# EAGLE design DPA110.thales verzia (EAGLE 5.10)
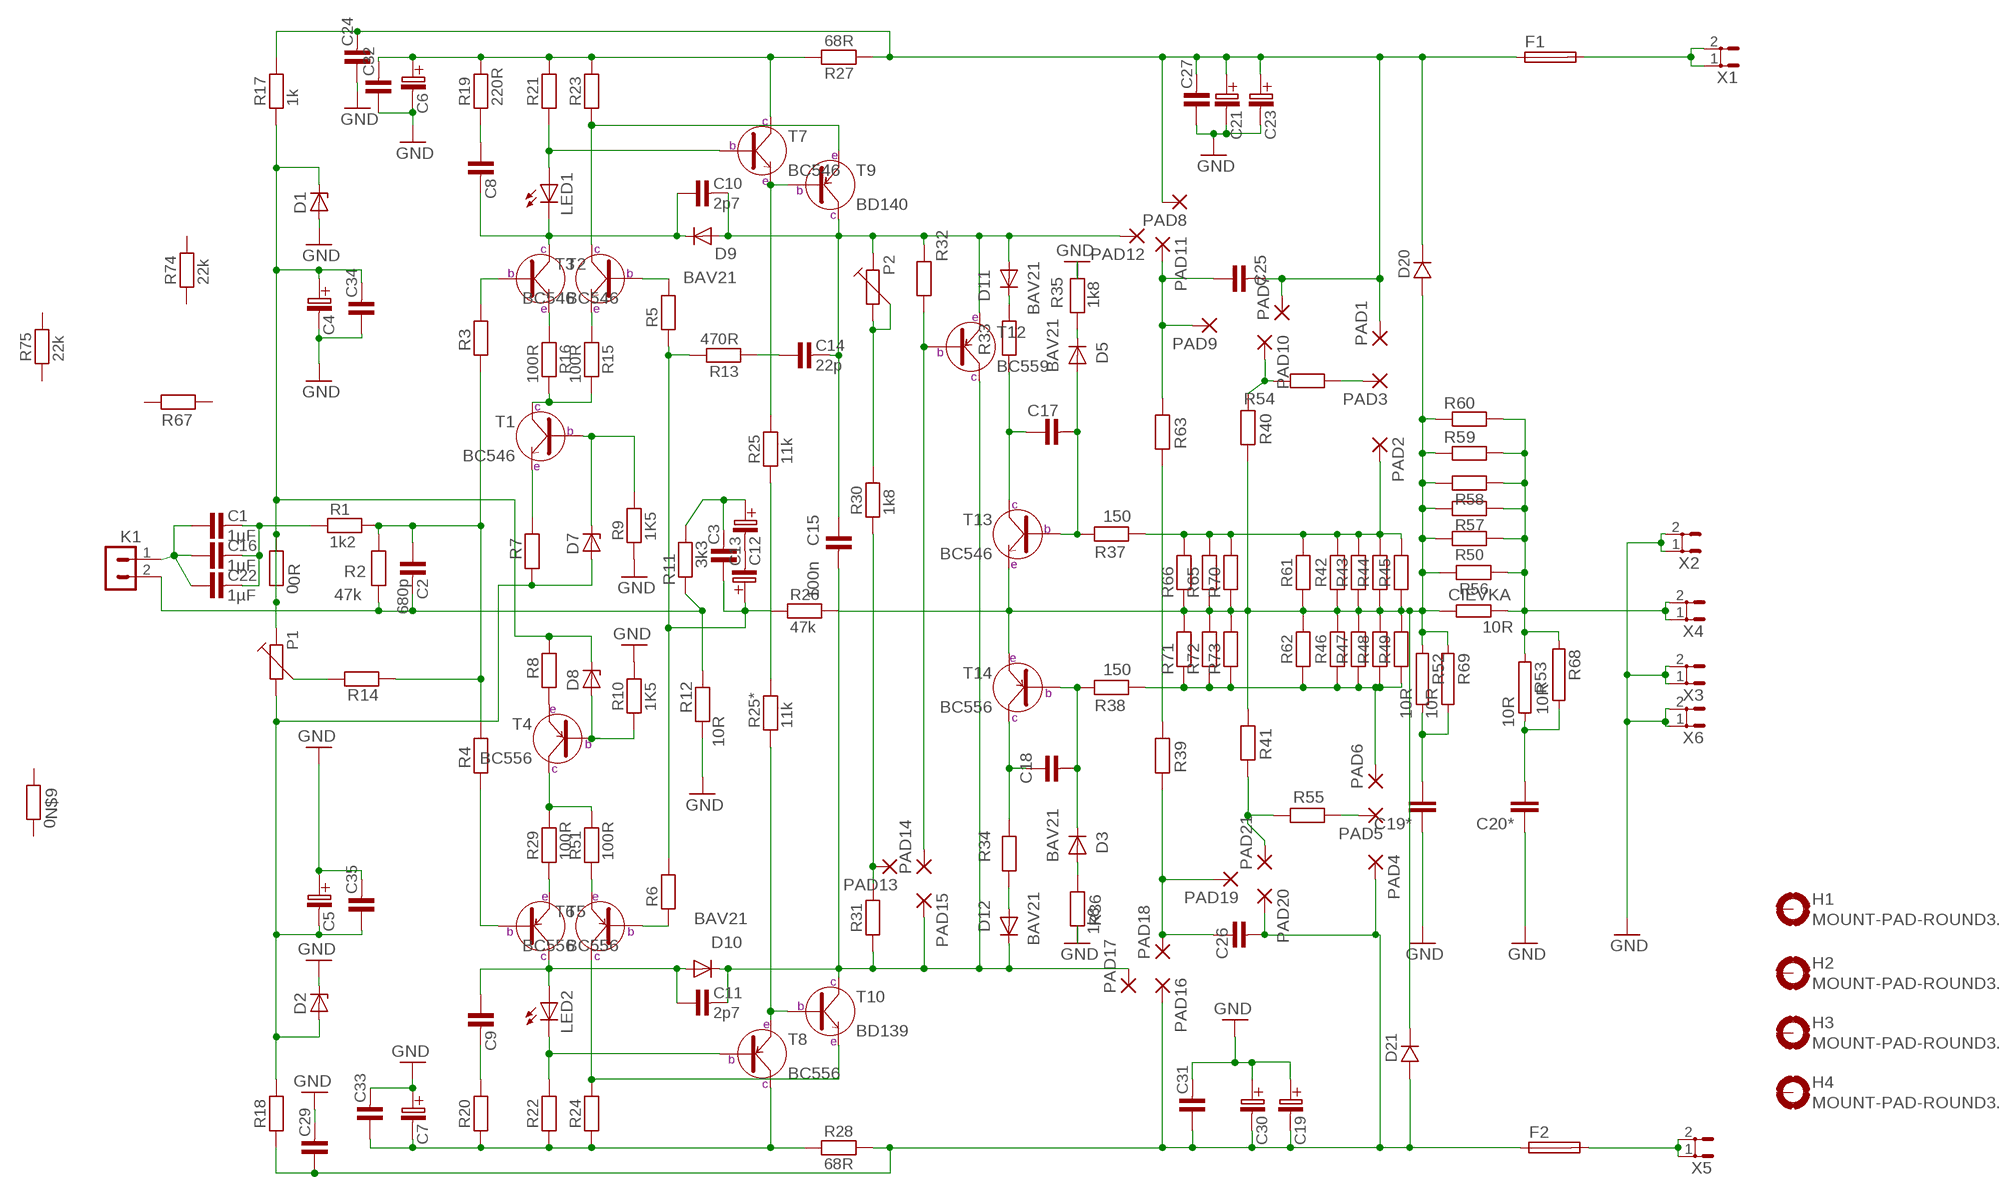
[diagram p0: schematic, sheet 1]

## Parts
0R  0  R_10  [R-10]
C1  1µF  C-KERAMIK_5  [C-5]
C2  680p  C-KERAMIK_5  [C-5]
C3  C-KERAMIK_5  [C-5]
C4  C-ELEKTROLYT_2  [C-EL_2]
C5  C-ELEKTROLYT_2  [C-EL_2]
C6  C-ELEKTROLYT_3,5  [C-EL_3,5]
C7  C-ELEKTROLYT_3,5  [C-EL_3,5]
C8  C-KERAMIK_5  [C-5]
C9  C-KERAMIK_5  [C-5]
C10  2p7  C-KERAMIK_5  [C-5]
C11  2p7  C-KERAMIK_5  [C-5]
C12  C-ELEKTROLYT_3,5  [C-EL_3,5]
C13  C-ELEKTROLYT_3,5  [C-EL_3,5]
C14  22p  C-KERAMIK_5  [C-5]
C15  100n  C-KERAMIK_5  [C-5]
C16  1µF  C-KERAMIK_5  [C-5]
C17  C-KERAMIK_5  [C-5]
C18  C-KERAMIK_5  [C-5]
C19  C-ELEKTROLYT_3,5  [C-EL_3,5]
C19*  C-EU150-054X183  [C150-054X183]
C20*  C-EU150-054X183  [C150-054X183]
C21  C-ELEKTROLYT_3,5  [C-EL_3,5]
C22  1µF  C-KERAMIK_5  [C-5]
C23  C-ELEKTROLYT_3,5  [C-EL_3,5]
C24  C-KERAMIK_5  [C-5]
C25  C-KERAMIK_5  [C-5]
C26  C-KERAMIK_5  [C-5]
C27  C-KERAMIK_5  [C-5]
C29  C-KERAMIK_5  [C-5]
C30  C-ELEKTROLYT_3,5  [C-EL_3,5]
C31  C-KERAMIK_5  [C-5]
C32  C-KERAMIK_5  [C-5]
C33  C-KERAMIK_5  [C-5]
C34  C-KERAMIK_5  [C-5]
C35  C-KERAMIK_5  [C-5]
CIEVKA  10R  R-EU_0617/22  [0617/22]
D1  BZD23  [SOD81]
D2  BZD23  [SOD81]
D3  BAV21  [DO35-10]
D5  BAV21  [DO35-10]
D7  BZX55  [DO35Z10]
D8  BZX55  [DO35Z10]
D9  BAV21  [DO35-10]
D10  BAV21  [DO35-10]
D11  BAV21  [DO35-10]
D12  BAV21  [DO35-10]
D20  D_10  [DO41]
D21  D_10  [DO41]
F1  SH22,5A  [SH22,5A]
F2  SH22,5A  [SH22,5A]
H1  MOUNT-PAD-ROUND3.3  [3,3-PAD]
H2  MOUNT-PAD-ROUND3.3  [3,3-PAD]
H3  MOUNT-PAD-ROUND3.3  [3,3-PAD]
H4  MOUNT-PAD-ROUND3.3  [3,3-PAD]
K1  PSH02-02P  [PSH02-02P]
LED1  LED5MM  [LED5MM]
LED2  LED5MM  [LED5MM]
N$9  0  R_10  [R-10]
P1  TRIMR64Y  [64Y]
P2  TRIMR64Y  [64Y]
PAD1  3,81/1,4  [3,81/1,4]
PAD2  3,81/1,4  [3,81/1,4]
PAD3  3,81/1,4  [3,81/1,4]
PAD4  3,81/1,4  [3,81/1,4]
PAD5  3,81/1,4  [3,81/1,4]
PAD6  3,81/1,4  [3,81/1,4]
PAD7  3,17/1,1  [3,17/1,1]
PAD8  3,17/1,1  [3,17/1,1]
PAD9  3,17/1,1  [3,17/1,1]
PAD10  3,17/1,1  [3,17/1,1]
PAD11  3,17/1,1  [3,17/1,1]
PAD12  3,17/1,1  [3,17/1,1]
PAD13  3,17/1,1  [3,17/1,1]
PAD14  3,17/1,1  [3,17/1,1]
PAD15  3,17/1,1  [3,17/1,1]
PAD16  3,17/1,1  [3,17/1,1]
PAD17  3,17/1,1  [3,17/1,1]
PAD18  3,17/1,1  [3,17/1,1]
PAD19  3,17/1,1  [3,17/1,1]
PAD20  3,17/1,1  [3,17/1,1]
PAD21  3,17/1,1  [3,17/1,1]
R1  1k2  R_10  [R-10]
R2  47k  R_10  [R-10]
R3  R_10  [R-10]
R4  R_10  [R-10]
R5  R_10  [R-10]
R6  R_10  [R-10]
R7  R_10  [R-10]
R8  R_10  [R-10]
R9  1K5  R_10  [R-10]
R10  1K5  R_10  [R-10]
R11  3k3  R_10  [R-10]
R12  10R  R_10  [R-10]
R13  470R  R_10  [R-10]
R14  R_10  [R-10]
R15  100R  R_7,5  [R-7,5]
R16  100R  R_7,5  [R-7,5]
R17  1k  R_10  [R-10]
R18  R_10  [R-10]
R19  220R  R_10  [R-10]
R20  R_10  [R-10]
R21  R_10  [R-10]
R22  R_10  [R-10]
R23  R_10  [R-10]
R24  R_10  [R-10]
R25  11k  R_10  [R-10]
R25*  11k  R_10  [R-10]
R26  47k  R_10  [R-10]
R27  68R  R_10  [R-10]
R28  68R  R_10  [R-10]
R29  100R  R_7,5  [R-7,5]
R30  1k8  R_10  [R-10]
R31  R_10  [R-10]
R32  R_10  [R-10]
R33  R_10  [R-10]
R34  R_10  [R-10]
R35  1k8  R_10  [R-10]
R36  1k8  R_10  [R-10]
R37  150  R_10  [R-10]
R38  150  R_10  [R-10]
R39  R_10  [R-10]
R40  R_10  [R-10]
R41  R_10  [R-10]
R42  R_10  [R-10]
R43  R_10  [R-10]
R44  R_10  [R-10]
R45  R_10  [R-10]
R46  R_10  [R-10]
R47  R_10  [R-10]
R48  R_10  [R-10]
R49  R_10  [R-10]
R50  R_10  [R-10]
R51  100R  R_7,5  [R-7,5]
R52  10R  RAC01  [AC01]
R53  10R  RAC01  [AC01]
R54  R_10  [R-10]
R55  R_10  [R-10]
R56  R_10  [R-10]
R57  R_10  [R-10]
R58  R_10  [R-10]
R59  R__2W  [R-_2W]
R60  R__2W  [R-_2W]
R61  R_10  [R-10]
R62  R_10  [R-10]
R63  R_10  [R-10]
R65  R__2W  [R-_2W]
R66  R__2W  [R-_2W]
R67  R_10  [R-10]
R68  10R  RAC01  [AC01]
R69  10R  RAC01  [AC01]
R70  R__2W  [R-_2W]
R71  R__2W  [R-_2W]
R72  R__2W  [R-_2W]
R73  R__2W  [R-_2W]
R74  22k  R_10  [R-10]
R75  22k  R_10  [R-10]
T1  BC546  [TO-92]
T2  BC546  [TO-92]
T3  BC546  [TO-92]
T4  BC556  [TO-92]
T5  BC556  [TO-92]
T6  BC556  [TO-92]
T7  BC546  [TO-92]
T8  BC556  [TO-92]
T9  BD140  [TO-126S]
T10  BD139  [TO-126S]
T12  BC559  [TO-92]
T13  BC546  [TO-92]
T14  BC556  [TO-92]
X1  ST4,8  [ST4,8]
X2  ST4,8  [ST4,8]
X3  ST4,8  [ST4,8]
X4  ST4,8  [ST4,8]
X5  ST4,8  [ST4,8]
X6  ST4,8  [ST4,8]

## Nets
AERT?ZQA??: R25*.2 R25.1
D7*: D8.A R10.1 T4.2(B)
GND: C4.C-(C_EL-) C5.C+(C_EL+) C6.C-(C_EL-) C7.C+(C_EL+) C19*.1 C19.C+(C_EL+) C20*.1 C21.C-(C_EL-) C23.C-(C_EL-) C24.1 C27.1 C29.2 C30.C+(C_EL+) C31.2 C32.1 C33.2 C34.1 C35.2 D1.A D2.C R9.1 R10.2 R12.1 R35.2 R36.1 X2.1 X2.2 X3.1 X3.2 X6.1 X6.2
N$1: C1.2 C16.2 C22.2 R1.1
N$2: C26.1 PAD18.1(P) PAD19.1(P) R39.1
N$3: C2.2 K1.2 R2.1 R11.1 R12.2
N$4: R7.2 T1.3(E)
N$5: C2.1 R1.2 R2.2 R3.1 R4.2 R14.1
N$6: R3.2 T2.2(B)
N$7: R16.1 T2.3(E)
N$8: D7.C R9.2 T1.2(B)
N$9: C5.C-(C_EL-) C35.1 D2.A D7.A P1.2 R7.1 R18.2
N$10: P1.3 R14.2
N$11: R8.1 T4.3(E)
N$12: R4.1 T5.2(B)
N$13: R29.1 T5.3(E)
N$14: R5.2 T3.2(B)
N$15: D5.C R35.1
N$16: R6.1 T6.2(B)
N$17: PAD3.1(P) R54.2
N$18: C3.1 C13.C+(C_EL+) R5.1 R6.2 R13.2 R26.1
N$19: C12.C-(C_EL-) C13.C-(C_EL-)
N$20: C6.C+(C_EL+) C32.2 R19.2 R21.2 R23.2 R27.2 T7.1(C)
N$21: C3.2 C12.C+(C_EL+) R11.2
N$22: C8.1 R19.1
N$23: C8.2 C10.1 D9.C LED1.K(C) T2.1(C)
N$24: LED2.K(C) R22.2 T8.2(B)
N$25: C19*.2 R52.2 R69.2
N$26: C25.1 PAD9.1(P) PAD11.1(P) R63.2
N$27: LED1.A R21.1 T7.2(B)
N$28: C9.2 R20.2
N$29: R23.1 T3.1(C) T9.1(E)
N$30: C7.C-(C_EL-) C33.1 R20.1 R22.1 R24.1 R28.1 T8.1(C)
N$31: R24.2 T6.1(C) T10.1(E)
N$33: R25.2 T7.3(E) T9.3(B)
N$34: C14.1 R13.1
N$35: C10.2 C14.2 C15.1 D9.A D11.A P2.1 PAD12.1(P) R32.2 T9.2(C) T12.3(E)
N$36: P2.2 P2.3 R30.2
N$37: C11.2 C15.2 D10.C D12.C PAD15.1(P) PAD17.1(P) R31.1 T10.2(C) T12.1(C)
N$38: PAD13.1(P) R30.1 R31.2
N$39: PAD14.1(P) R32.1 T12.2(B)
N$40: R15.1 T3.3(E)
N$41: PAD5.1(P) R55.1
N$42: D11.C R33.2
N$43: C17.1 R33.1 T13.1(C)
N$44: D12.A R34.1
N$45: C18.1 R34.2 T14.1(C)
N$46: D3.A R36.2
N$47: C17.2 D5.A R37.1 T13.2(B)
N$48: C18.2 D3.C R38.1 T14.2(B)
N$49: R15.2 R16.2 T1.1(C)
N$50: R39.2 R63.1
N$51: R51.1 T6.3(E)
N$53: C21.C+(C_EL+) C23.C+(C_EL+) C24.2 C25.2 C27.2 D20.K F1.1 PAD1.1(P) PAD7.1(P) PAD8.1(P) R17.2 R27.1
N$54: C19.C-(C_EL-) C26.2 C29.1 C30.C-(C_EL-) C31.1 D21.A F2.1 PAD4.1(P) PAD16.1(P) PAD20.1(P) R18.1 R28.2
N$55: R29.2 R51.2 T4.1(C)
N$56: PAD10.1(P) R40.2 R54.1
N$57: PAD21.1(P) R41.1 R55.2
N$58: PAD2.1(P) R37.2 R42.2 R43.2 R44.2 R45.2 R61.2 R65.2 R66.2 R70.2
N$59: PAD6.1(P) R38.2 R46.1 R47.1 R48.1 R49.1 R62.1 R71.1 R72.1 R73.1
N$61: F1.2 X1.1 X1.2
N$63: F2.2 X5.1 X5.2
N$67: C9.1 C11.1 D10.A LED2.A T5.1(C)
N$76: CIEVKA.1 D20.A D21.K R26.2 R40.1 R41.2 R42.1 R43.1 R44.1 R45.1 R46.2 R47.2 R48.2 R49.2 R50.2 R52.1 R56.2 R57.2 R58.2 R59.1 R60.1 R61.1 R62.2 R65.1 R66.1 R69.1 R70.1 R71.2 R72.2 R73.2 T13.3(E) T14.3(E)
N$77: R25*.1 T8.3(E) T10.3(B)
N$89: 0R.1 0R.2 C4.C+(C_EL+) C34.2 D1.C D8.C P1.1 R8.2 R17.1
N$180: C20*.2 R53.2 R68.2
N$181: C1.1 C16.1 C22.1 K1.1
OUT: CIEVKA.2 R50.1 R53.1 R56.1 R57.1 R58.1 R59.2 R60.2 R68.1 X4.1 X4.2
Unconnected: H1.B3,3(MOUNT) H2.B3,3(MOUNT) H3.B3,3(MOUNT) H4.B3,3(MOUNT) N$9.1 N$9.2 R67.1 R67.2 R74.1 R74.2 R75.1 R75.2

## Library data of the parts
0R N$9 R1-R3 R5-R12 R14 R19-R24 R25* R26-R28 R30 R31 R33 R34 = #PaJa_30:R: Rezistor
C1-C3 C10 C11 C14-C18 C22 C24-C27 C29 C31-C35 = #PaJa_22:C-KERAMIK: Kondenzator - keramicky
C4-C7 C12 C13 C19 C21 C23 C30 = #PaJa_22:C-ELEKTROLYT: Kondenzator - elektrolyticky
C8 C9 = #PaJa_30:C-KERAMIK: Kondenzator - keramicky
C19* C20* = rcl:C-EU: CAPACITOR, European symbol
CIEVKA = rcl:R-EU_: RESISTOR, European symbol
D1 D2 = DIODE moje:BZD23: Z DIODE
D3 D5 D9-D12 = DIODE moje:BAV21: DIODE high-voltage general purpose diode
D7 D8 = DIODE moje:BZX55: Z DIODE
D20 D21 = #PaJa_22:D: Dioda - univerzální
F1 F2 = fuse:SH22,5A: FUSE HOLDER grid 22,5mm, isolated cap OGN0031 8201, Schurter (Buerklin)
H1-H4 = holes:MOUNT-PAD-ROUND: MOUNTING PAD, round
K1 = #PaJa_22:PSH02-02: Konektory se zamkem - vidlice - 2pin
LED1 LED2 = LED moje:LED: LED OSRAM: - CHIPLED LG R971, LG N971, LY N971, LG Q971, LY Q971, LO R971, LY R971 LH N974, LH R974 LS Q976, LO Q976, LY Q976 LO Q996 - Hyper CHIPLED LW Q18S LB Q993, LB Q99A, LB R99A - SideLED LS A670, LO A670, LY A670, LG A670, LP A670 LB A673, LV A673, LT A673, LW A673 LH A674 LY A675 LS A676, LA A676, LO A676, LY A676, LW A676 LS A679, LY A679, LG A679 - Hyper Micro SIDELED® LS Y876, LA Y876, LO Y876, LY Y876 LT Y87S - SmartLED LW L88C, LW L88S LB L89C, LB L89S, LG L890 LS L89K, LO L89K, LY L89K LS L896, LA L896, LO L896, LY L896 - TOPLED LS T670, LO T670, LY T670, LG T670, LP T670 LSG T670, LSP T670, LSY T670, LOP T670, LYG T670 LG T671, LOG T671, LSG T671 LB T673, LV T673, LT T673, LW T673 LH T674 LS T676, LA T676, LO T676, LY T676, LB T676, LH T676, LSB T676, LW T676 LB T67C, LV T67C, LT T67C, LS T67K, LO T67K, LY T67K, LW E67C LS E67B, LA E67B, LO E67B, LY E67B, LB E67C, LV E67C, LT E67C LW T67C LS T679, LY T679, LG T679 LS T770, LO T770, LY T770, LG T770, LP T770 LB T773, LV T773, LT T773, LW T773 LH T774 LS E675, LA E675, LY E675, LS T675 LS T776, LA T776, LO T776, LY T776, LB T776 LHGB T686 LT T68C, LB T68C - Hyper Mini TOPLED® LB M676 - Mini TOPLED Santana® LG M470 LS M47K, LO M47K, LY M47K Source: http://www.osram.convergy.de/
P1 P2 = #PaJa_30:TRIMR: Trimr
PAD1-PAD6 = wirepad:3,81/1,4: THROUGH-HOLE PAD
PAD7-PAD21 = wirepad:3,17/1,1: THROUGH-HOLE PAD
R4 R13 R15-R18 R25 R29 R32 R35-R51 R54-R63 R65-R67 R70-R75 = #PaJa_22:R: Rezistor
R52 R53 R68 R69 = resistor-power:R: Power Resitor
T1-T3 T7 T13 = #PaJa_22:BC546: Tranzistor NPN - Univerzalni NF - Ic=0,1A
T4-T6 T8 T14 = #PaJa_22:BC556: Tranzistor PNP - Univerzalni NF - Ic=0,1A
T9 = #PaJa_22:BD140: Tranzistor PNP - Vykonovy - Ic=1,5A
T10 = #PaJa_22:BD139: Tranzistor NPN - Vykonovy - Ic=1,5A
T12 = #PaJa_22:BC559: Tranzistor PNP - Univerzalni NF - Ic=0,1A
X1-X6 = con-rib:ST4,8: RIBBON CABLE CONNECTOR Flachstecker / Faston

## Board
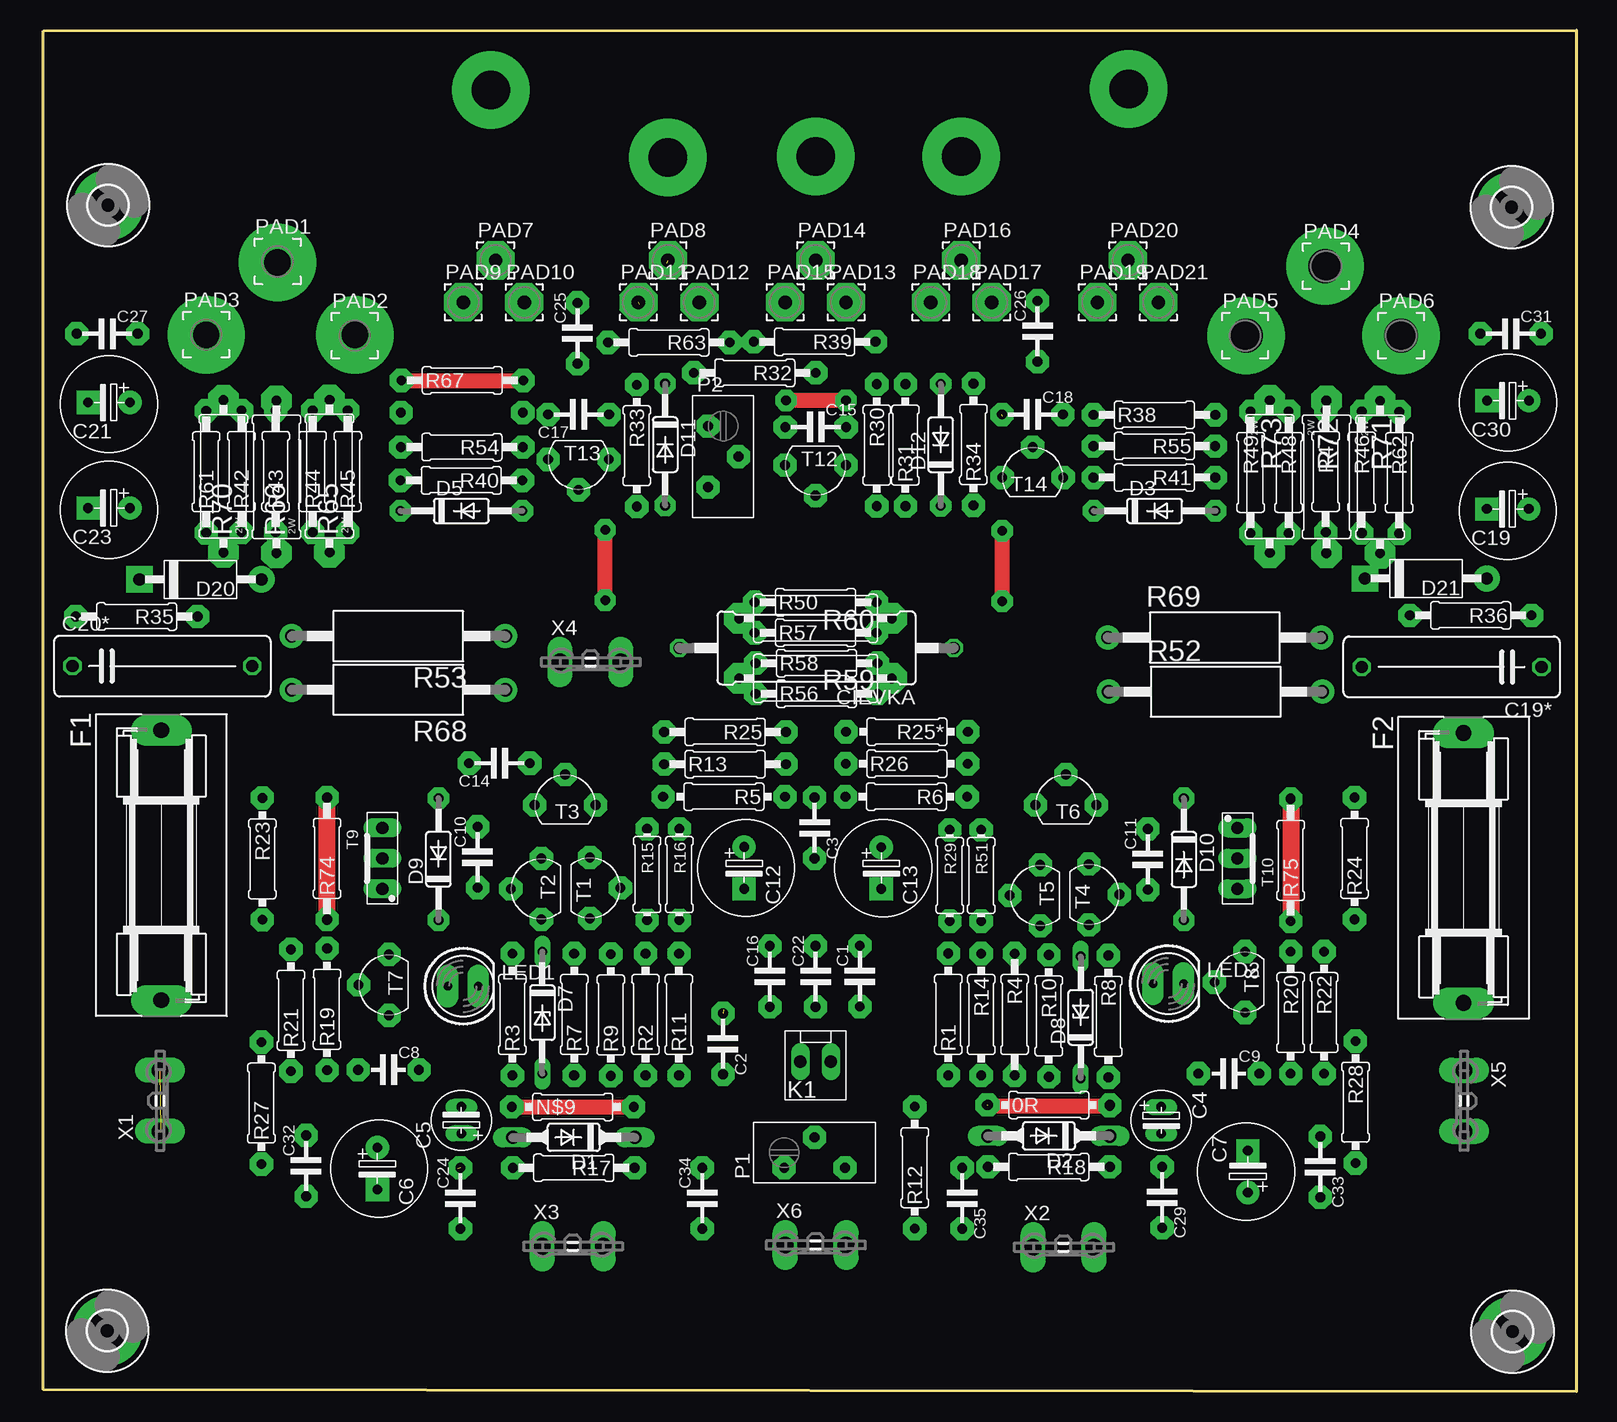
[diagram p1: board, top side]
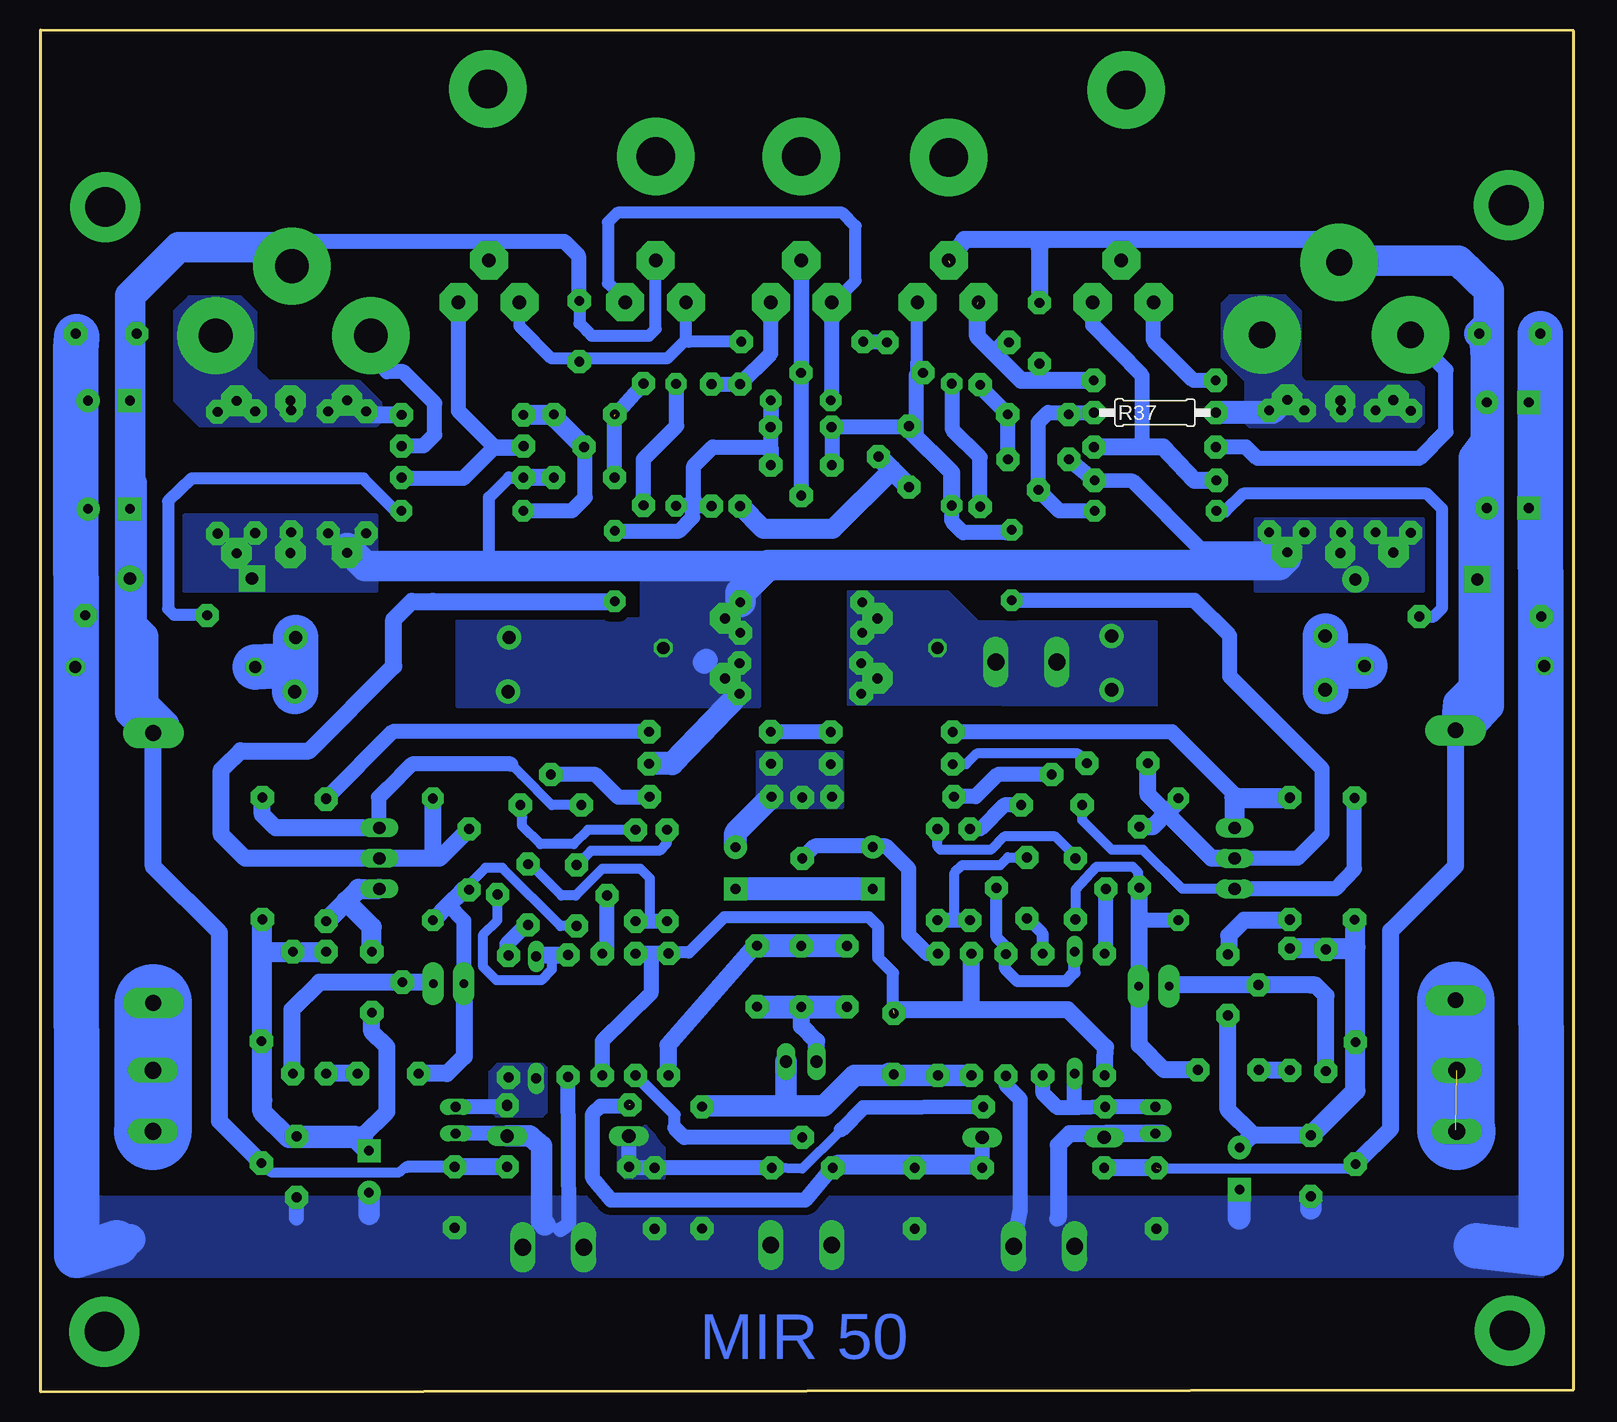
[diagram p2: board, bottom side, seen from below]

Size 127.79 x 113.51 mm. Coordinates in mm from the lower left corner, seen from the top.
Outline: 0,113.43 127.79,113.51 127.79,0 0,0.16 0,113.43
Copper layers (1*16): Top 0.035mm / dielectric 1.5mm / Bottom 0.035mm
Design rules "default": minimum track width 10mil, minimum drill 24mil, track to track 8mil, track to pad 8mil, pad to pad 8mil, via to via 8mil, smd to smd 8mil, copper to edge 40mil, drill to drill 8mil, minimum pad ring 10mil, minimum via ring 8mil, stop-mask expansion 4mil, vias tented up to drill 0mil, thermal gap 10mil

### Footprints (pad centres in the part's own frame; a part is rotated, then mirrored left to right if it is on the bottom)
R-10 = drill 0.813 pad 1.93 octagon: 1 -5.08,0; 2 5.08,0
C-5 = drill 0.813 pad 1.93 octagon: 1 -2.54,0; 2 2.54,0
C-EL_2 = drill 0.813 pad 1.27 long: C+ 0,0; C- 2.223,0
C-EL_3,5 = drill 0.813 pad 1.93 round: C+ 0,0 | drill 0.813 pad 1.93 square: C- 3.493,0
C150-054X183 = drill 1.016 octagon: 1 -7.493,0; 2 7.493,0
0617/22 = drill 1.016 octagon: 1 -11.43,0; 2 11.43,0
SOD81 = drill 1.118 long: A 5.08,0; C -5.08,0
DO35-10 = drill 0.813 pad 1.778 octagon: A 5.08,0; C -5.08,0
DO35Z10 = drill 0.813 long: A 5.08,0; C -5.08,0
DO41 = drill 1.016 pad 2.184 round: A -5.08,0 | drill 1.016 pad 2.184 square: K 5.08,0
SH22,5A = drill 1.321 pad 2.54 long: 1 -11.252,0; 2 11.252,0
3,3-PAD = drill 3.3 pad 5.842 round: B3,3 0,0
PSH02-02P = drill 1.016 pad 1.422 long: 1 -1.27,0; 2 1.27,0
LED5MM = drill 0.7 pad 1.778 long: A -1.27,0; K 1.27,0
64Y = drill 0.813 pad 1.93 octagon: 1 0,2.54; 2 0,-2.54; 3 2.54,0
3,81/1,4 = drill 1.397 pad 3.81 octagon: 1 0,0
3,17/1,1 = drill 1.118 pad 3.175 octagon: 1 0,0
R-7,5 = drill 0.813 pad 1.93 octagon: 1 -3.81,0; 2 3.81,0
AC01 = drill 1.1 pad 2 round: 1 -8.9,0; 2 8.9,0
R-_2W = drill 0.813 pad 2.54 octagon: 1 -6.35,0; 2 6.35,0
TO-92 = drill 0.813 pad 1.93 octagon: 1 0,2.54; 2 2.54,0; 3 0,-2.54
TO-126S = drill 1.016 pad 1.6 long: 1 -2.54,0; 2 0,0; 3 2.54,0
ST4,8 = drill 1.397 long: 1 -2.54,0; 2 2.54,0

### Placement (x,y rotation side)
0R  83.82,23.89 0 top
C1  68.06,34.62 90 top
C2  56.66,28.99 270 top
C3  64.29,46.99 270 top
C4  93.19,23.73 270 top
C5  34.85,21.51 90 top
C6  27.84,20.34 270 top
C7  100.41,16.59 90 top
C8  28.77,26.83 0 top
C9  98.82,26.51 0 top
C10  36.2,44.55 90 top
C11  92.07,44.37 90 top
C12  58.42,45.4 270 top
C13  69.85,45.39 270 top
C14  38.02,52.39 180 top
C15  64.39,80.41 0 top
C16  60.56,34.61 90 top
C17  44.62,81.46 180 top
C18  82.45,81.45 0 top
C19  123.82,73.58 180 top
C19*  117.4,60.4 180 top
C20*  9.92,60.48 0 top
C21  7.22,82.46 180 top
C22  64.37,34.61 90 top
C23  7.22,73.66 180 top
C24  34.77,16.11 90 top
C25  44.53,88.23 90 top
C26  82.88,88.39 90 top
C27  5.32,88.19 0 top
C29  93.27,16.19 270 top
C30  123.84,82.61 180 top
C31  122.32,88.19 0 top
C32  21.91,18.81 90 top
C33  106.44,18.73 270 top
C34  54.93,16.11 90 top
C35  76.6,16.11 270 top
CIEVKA  64.45,61.99 180 top
D1  44.21,21.19 180 top
D2  83.82,21.31 180 top
D3  92.63,73.42 0 top
D5  34.85,73.42 0 top
D7  41.59,31.59 270 top
D8  86.48,31.19 90 top
D9  32.94,44.39 90 top
D10  95.08,44.37 270 top
D11  51.83,78.95 270 top
D12  74.81,78.92 90 top
D20  13.1,67.71 180 top
D21  115.25,67.79 180 top
F1  9.83,43.88 270 top
F2  118.39,43.66 270 top
H1  5.4,98.9 0 top
H2  122.4,98.74 0 top
H3  5.32,5.08 0 top
H4  122.48,5 0 top
K1  64.37,27.51 0 top
LED1  34.99,33.8 0 top
LED2  93.78,34.01 0 top
N$9  44.13,23.73 0 top
P1  64.29,18.65 90 top
P2  55.4,77.95 0 top
PAD1  19.53,94.22 0 top
PAD2  25.96,88.03 0 top
PAD3  13.57,88.11 0 top
PAD4  106.92,93.82 0 top
PAD5  100.17,88.03 0 top
PAD6  113.19,88.03 0 top
PAD7  37.7,94.3 0 top
PAD8  52.07,94.3 0 top
PAD9  35,90.8 0 top
PAD10  40.08,90.81 0 top
PAD11  49.61,90.81 0 top
PAD12  54.69,90.81 0 top
PAD13  66.91,90.81 0 top
PAD14  64.37,94.3 0 top
PAD15  61.83,90.81 0 top
PAD16  76.52,94.3 0 top
PAD17  79.06,90.81 0 top
PAD18  73.98,90.81 0 top
PAD19  87.87,90.81 0 top
PAD20  90.41,94.3 0 top
PAD21  92.95,90.81 0 top
R1  75.44,31.45 90 top
R2  50.2,31.43 90 top
R3  39.09,31.43 90 top
R4  80.96,31.43 270 top
R5  56.74,49.59 180 top
R6  71.94,49.59 180 top
R7  44.25,31.43 90 top
R8  88.78,31.27 270 top
R9  47.31,31.39 90 top
R10  83.82,31.31 270 top
R11  52.98,31.43 90 top
R12  72.64,18.67 90 top
R13  56.83,52.31 0 top
R14  78.18,31.43 270 top
R15  50.32,43.1 270 top
R16  53.02,43.1 270 top
R17  44.21,18.65 180 top
R18  83.82,18.73 180 top
R19  23.65,31.87 90 top
R20  103.98,31.59 270 top
R21  20.64,31.79 90 top
R22  106.76,31.59 270 top
R23  18.26,44.41 270 top
R24  109.3,44.45 90 top
R25  56.83,54.99 180 top
R25*  71.99,55.01 180 top
R26  71.98,52.34 0 top
R27  18.18,24.05 90 top
R28  109.38,24.13 270 top
R29  75.56,43.02 270 top
R30  69.48,78.9 270 top
R31  71.86,78.9 90 top
R32  59.31,84.93 180 top
R33  49.47,78.85 270 top
R34  77.53,78.95 90 top
R35  7.78,64.61 180 top
R36  118.98,64.71 180 top
R37  34.89,81.61 0 bottom
R38  92.61,81.42 0 top
R39  64.29,87.52 180 top
R40  34.85,75.96 180 top
R41  92.61,76.2 180 top
R42  16.51,76.71 90 top
R43  19.37,76.71 90 top
R44  22.45,76.71 90 top
R45  25.37,76.71 90 top
R46  109.9,76.64 270 top
R47  106.9,76.71 270 top
R48  103.81,76.63 270 top
R49  100.65,76.63 270 top
R50  64.37,65.8 0 top
R51  78.18,43.02 270 top
R52  97.71,58.34 0 top
R53  29.61,62.98 180 top
R54  34.89,78.74 180 top
R55  92.61,78.82 180 top
R56  64.45,58.18 0 top
R57  64.37,63.26 0 top
R58  64.45,60.72 0 top
R59  64.37,59.45 180 top
R60  64.37,64.45 180 top
R61  13.57,76.68 90 top
R62  113.03,76.6 270 top
R63  52.15,87.47 180 top
R65  23.86,76.32 90 top
R66  19.44,76.25 90 top
R67  34.92,84.3 0 top
R68  29.61,58.5 180 top
R69  97.63,62.87 0 top
R70  15.01,76.3 90 top
R71  111.44,76.23 270 top
R72  106.96,76.26 270 top
R73  102.23,76.28 270 top
R74  23.65,44.45 90 top
R75  103.98,44.29 90 top
T1  45.56,41.99 0 top
T2  41.51,41.91 180 top
T3  43.5,48.9 90 top
T4  87.15,41.43 0 top
T5  83.11,41.35 180 top
T6  85.25,48.9 90 top
T7  28.81,33.89 180 top
T8  100.17,34.13 180 top
T9  28.26,44.45 90 top
T10  99.54,44.45 270 top
T12  64.37,77.23 270 top
T13  44.61,77.71 270 top
T14  82.47,76.2 90 top
X1  9.73,24.24 90 top
X2  85.04,12.03 0 top
X3  44.13,12.11 0 top
X4  45.61,60.82 0 top
X5  118.43,24.24 270 top
X6  64.37,12.22 0 top

### Tracks (layer width: path | path; a pad name or v marks a point on that pad's centre or on a via)
AERT?ZQA??
  Bottom 1.27: R25.1 66.85,54.99 R25*.2
D7*
  Bottom 0.813: T4.2 89.69,39.29 90.88,38.1 90.88,35.4 89.77,34.29 86.04,34.29 85.17,35.16 85.17,36.39
  Bottom 1.422: R10.1 85.17,36.39 86.2,36.39 D8.A
GND
  Bottom 1.27: R10.2 83.74,13.97 84.45,13.49 | 85.72,13.89 85.96,13.65 85.88,13.65 85.8,13.73 | C23.C- | 124.78,87.95 123.84,87.95 C30.C+ C19.C+ 124.06,73.58 R36.1 123.82,64.71 C19*.1 | C27.1 3.73,88.19 C21.C- C23.C- | C23.C- | C23.C- R35.2 3.73,64.61 C20*.1 | C4.C- 88.94,21.51 D2.C | C5.C+ 41.99,21.51 42.94,20.56 | 42.94,14.53 43.1,14.37 | R9.1 47.31,25.56 46.12,24.37 46.12,15.13 X3.2 | 106.36,16.27 106.44,16.27 106.44,14.45
  Bottom 1.422: D1.A 39.05,21.51 34.21,21.51 41.99,21.51 42.94,20.56 42.94,14.53
  Bottom 1.778: D2.C 87.03,21.31 86.04,20.48 86.04,14.21 85.72,13.89 | 100.41,14.76 C7.C+ | C32.1 21.91,15.56 21.91,15.24 | C31.2 124.86,87.23 124.86,86.91
  Bottom 1.93: 27.86,14.45 27.86,16.83
  Bottom 2.54: 121.44,12.38 120.33,12.7
  Bottom 3.81: C27.1 2.78,87.55 2.7,11.51 8.1,12.14 | 121.44,12.38 124.78,11.35 124.86,86.91 124.78,87.95
  pour Bottom (isolate 0.61, no thermals): 1.03,16.19 125.49,16.19 125.33,9.6 2.54,9.6
N$1
  Bottom 1.27: C1.2 67.4,37.16 67.39,37.15
  Bottom 1.422: C22.2 67.39,37.15 68.26,37.15 75.49,28.89 75.49,26.42 R1.1
  Bottom 1.93: C1.2 60.58,37.16 C16.2
N$2
  Bottom 1.016: R39.1 73.74,87.52 | 73.74,87.52 74.17,87.52 75.56,86.12 82.95,86.12 | 82.95,86.12 85.17,86.12 87.87,88.82 87.87,91.12 PAD19.1 | C26.1 82.88,85.64 82.95,85.8 82.95,86.12 | PAD18.1 73.98,87.76 73.74,87.52
N$3
  Bottom 1.778: R2.1 57.23,26.35 | 57.23,26.35 59.93,26.35 62.47,23.81 66.12,23.81 | 66.12,23.81 72.58,23.81 R12.2 | K1.2 65.64,24.29 66.12,23.81 | C2.2 57.06,26.53 57.23,26.35 | R2.1 R11.1 | R2.1
N$4
  Bottom 1.016: R7.2 44.25,38.14 T1.3
N$5  (1 unrouted)
  Bottom 1.016: 56.72,31.83 56.72,34.89 57.94,36.12 57.94,38.73 58.74,39.53 70.8,39.53 73.74,36.59 75.37,36.59 R1.2
  Bottom 1.27: R4.2 80.96,29.21 76.91,33.18 76.91,36.53 | R1.2 76.91,36.53 | 76.91,36.53 78.33,36.53 R14.1
  Bottom 1.422: R3.1 39.01,28.69 42.15,31.83 50.24,31.83 | 50.24,31.83 56.72,31.83 | R2.2 50.2,31.88 50.24,31.83
N$6
  Bottom 1.27: T2.2 38.97,36.63 R3.2
N$7
  Bottom 0.813: T2.3 41.51,44.61 43.18,46.28 47.47,46.28 48.58,45.16 52.78,45.16 53.02,45.4 R16.1 | R16.1
N$8
  Bottom 1.016: D7.C 41.59,34.92 42.31,34.21 46.35,34.21 47.39,35.24 47.39,36.59 47.39,37.15 48.1,37.86 T1.2 | T1.2
  Bottom 1.422: R9.2 47.31,36.51 47.39,36.59
N$9  (via drill 0.6 pad 1.68)
  Top 1.27: v39.05,23.73 v49.21,23.73
  Bottom 0.813: 61.04,21.83 61.2,21.67 64.29,18.57 P1.2
  Bottom 1.27: P1.2 74.69,18.65 | 74.69,18.65 78.5,18.65 R18.2 78.74,21.23 D2.A | C35.1 76.44,18.65 74.69,18.65 | C5.C- v39.05,23.73 41.27,23.65 | v49.21,23.73 59.21,23.65 61.04,21.83 | 41.27,23.65 43.02,23.65 44.21,24.84 44.21,26.31 R7.1 | D7.A 41.59,23.97 41.27,23.65
  pour Bottom (isolate 1.016, no thermals): 79.3,22.3 77.47,22.3 75.8,20.48 75.8,17.78 79.06,17.78 79.61,18.34 79.61,21.99
N$10
  Bottom 1.016: 74.93,21.99 74.93,23.1 R14.2
  Bottom 1.27: P1.3 74.14,21.19 74.93,21.99
N$11
  Bottom 1.27: T4.3 87.31,38.89 88.9,37.31 88.9,36.39 R8.1
N$12
  Bottom 1.27: T5.2 80.57,36.91 R4.1
N$13
  Bottom 0.813: R29.1 75.56,45.72 76.2,45.08 81.91,45.08 T5.3
N$14
  Bottom 1.27: T3.2 48.02,51.44 49.85,49.61 51.64,49.61 R5.2
N$15
  Bottom 1.016: D5.C 29.05,73.34 27.54,74.85 12.22,74.85 10.95,73.58 10.95,65.33 11.67,64.61 12.78,64.53 R35.1
N$16
  Bottom 1.27: T6.2 81.52,51.43 79.61,49.53 77.08,49.53 R6.1
N$17
  Bottom 1.27: R54.2 27.3,78.74 26.35,77.79 12.86,77.79 10.64,80.01 10.64,85.17 PAD3.1
N$18
  Bottom 1.93: C13.C+ 69.85,46.6 R6.2
  pour Bottom (no thermals): 60.96,52.86 60.96,48.66 68.02,48.66 68.02,53.34 60.96,53.34
N$19
  Bottom 1.93: C12.C- 69.83,41.91 C13.C-
N$20
  Bottom 1.422: 18.18,25.08 C32.2 26.67,21.35 26.75,21.43 | 26.75,21.43 28.81,23.49 T7.1 | T7.1 | C6.C+ | 26.75,21.43 C6.C+
  Bottom 1.676: 18.18,37.07 R27.2 18.18,25.08 C32.2 | 18.18,37.07 18.18,39.25 R23.2 | 18.3,36.95 R19.2 | 18.18,37.07 18.3,36.95 | R21.2 18.37,36.87 18.3,36.95
N$21
  Bottom 1.27: R11.2 53.9,36.51 55.4,38.02 55.4,43.58 57.31,45.48 57.86,45.48 | 57.86,45.48 63.26,45.48 C3.2 | C12.C+ 57.94,45.4 57.86,45.48
N$22
  Bottom 1.422: R19.1 25.16,26.79 C8.1
N$23
  Bottom 0.813: T2.1 41.51,41.83 39.77,43.74 36.75,43.74 36.27,43.26 36.27,41.93 C10.1
  Bottom 1.016: LED1.K 36.26,29.83 36.19,29.77
  Bottom 1.27: D9.C 35.89,39.31 36.19,39.61
  Bottom 1.422: C8.2 34.13,26.83 36.19,28.89 36.19,29.77 36.19,39.61 36.19,41.69 C10.1
N$24
  Bottom 1.422: LED2.K 95.01,34.13 T8.2 104.54,34.13 106.84,31.83 106.84,26.59 R22.2
N$25
  Bottom 3.81: 106.53,60.72 106.53,58.42 R52.2 | 106.53,60.72 R69.2 | C19*.2 106.69,60.56 106.53,60.72
N$26  (via drill 0.8 pad 1.78)  (1 unrouted)
  Top 1.27: v29.84,84.3 v40,84.3
  Bottom 1.27: v29.84,84.3 31.67,84.3 35,87.63 PAD9.1 | PAD9.1
  Bottom 1.422: v40,84.3 44.37,84.3 | 44.37,84.3 46.04,84.3 48.3,86.56 | 48.3,86.56 49.69,87.95 49.69,90.65 | R63.2 47.39,87.47 48.3,86.56 | C25.1 44.53,84.46 44.37,84.3
N$27
  Bottom 1.422: R21.1 20.64,33.02 21.51,33.89 21.91,33.89 | 21.91,33.89 33.62,33.89 LED1.A | 21.91,33.89 T7.2 | 21.91,33.89
N$28
  Bottom 1.422: C9.2 103.9,26.51 R20.2
N$29
  Bottom 0.813: T9.1 32.62,41.91 35.88,45.16 38.5,45.16 40.96,47.63 T3.1
  Bottom 1.27: T9.1 19.84,41.91 18.26,43.58 18.26,49.41 R23.1
N$30
  Bottom 1.422: T8.1 100.17,30 98.9,28.73 98.9,23.34 100.89,21.35 101.28,20.95 | R28.1 109.38,24.37 109.3,24.29
  Bottom 1.676: 109.3,36.75 109.3,24.29 109.3,23.34 107.08,21.11 101.12,21.11 100.89,21.35 | 109.3,36.75 109.3,36.83 | 109.3,36.83 R24.1 | R20.1 109.22,36.67 109.3,36.75 | R22.1 109.14,36.67 109.3,36.83
  Bottom 1.778: C33.1 101.6,21.27 101.28,20.95 C7.C-
N$31
  Bottom 0.813: T6.1 85.17,48.89 87.71,51.43 | 87.71,51.43 | 87.71,51.43 88.58,52.31
  Bottom 1.27: 88.58,52.31 96.84,52.31 98.9,50.24 | 98.9,50.24 | 98.9,50.24 99.62,49.53 99.62,47.07 T10.1
  Bottom 1.422: R24.2 109.3,48.1 108.19,46.99 T10.1
N$32  (via drill 0.6 pad 3.81)
  other vias: 37.46,108.59
N$33  (via drill 0.8 pad 1.78)
  Top 1.422: v23.65,39.29 v23.65,49.45
  Bottom 1.27: R25.2 33.48,54.99 27.94,49.45
  Bottom 1.422: v23.65,39.29 27.46,39.29 28.73,38.02 28.73,36.51 T7.3 | 28.1,49.45 28.26,49.45 | 28.26,49.45
  Bottom 1.676: 28.26,49.61 28.26,49.45 T9.3 | v23.65,49.45 27.94,49.45 28.1,49.45
N$34
  Bottom 0.813: R13.1 50.64,52.31 49.77,53.18 41.27,53.18 40.48,52.39 40.72,52.47 C14.1
N$35  (via drill 0.8 pad 1.78)
  Top 1.27: v46.83,65.96 v46.83,71.83
  Bottom 1.016: PAD12.1 54.77,84.3
  Bottom 1.27: T12.3 61.83,80.39 C15.1 55.48,80.41 P2.1 54.77,79.69 54.77,84.3 54.77,84.85 54.69,84.93 R32.2 | v46.83,71.83 47.07,71.83 47.31,71.6 50.88,71.6 51.75,72.47 51.75,72.55 51.83,72.63 D11.A | T9.2 23.02,44.45 20.95,46.51 20.95,51.91 28.65,59.61 28.65,63.02 31.59,65.96 v46.83,65.96
  Bottom 1.422: P2.1 55.4,80.17 51.83,76.6 D11.A | T9.2 30.16,44.45 33.93,48.22 | 33.93,48.22 35.48,49.77 C14.2 | D9.A 32.94,49.21 33.93,48.22 | C10.2 35.07,47.08 33.93,48.22
N$36
  Bottom 1.676: R30.2 69.45,73.82 67.55,71.91 61.75,71.91 56.83,76.83 | P2.2 56.83,76.83 | 56.83,76.83 P2.3
N$37  (via drill 0.8 pad 1.78)
  Top 1.27: v66.91,82.63 v61.91,82.63 | v79.93,71.75 79.93,66.2 v79.93,65.88
  Bottom 1.016: PAD17.1 79.06,90.96 80.49,92.39 80.49,97.47 79.69,98.27 60.96,98.27 59.85,97.15 59.85,92.63 61.67,90.8 PAD15.1
  Bottom 1.27: C15.2 66.91,80.55 v66.91,82.63 T12.1 66.91,78.74 | 73.42,73.84 71.99,73.84 R31.1 | 73.42,73.84 D12.C | 66.91,78.74 | 66.91,78.74 71.75,78.74 73.18,77.31 | 73.18,77.31 | 73.18,77.31 73.34,77.15 73.34,74.45 | 73.34,74.45 73.34,73.92 73.42,73.84 | v79.93,71.75 74.53,71.75 73.42,72.87 73.42,74.37 73.34,74.45 | 107.63,53.34 111.2,53.34 112.47,52.07 112.71,51.83 | C11.2 94.61,44.37 94.93,44.37 95.08,44.51 95.08,44.69 95.31,44.45 T10.2 | PAD15.1 61.83,82.71 v61.91,82.63 | 95.09,65.88
  Bottom 1.422: v79.93,65.88 95.09,65.88 96.84,65.88 98.35,64.37 98.35,60.48 105.41,53.42 111.12,53.42 112.47,52.07 | 112.71,51.83 112.71,46.43 110.73,44.45 94.54,44.45 C11.2 | 95.08,44.69 D10.C
N$38
  Bottom 1.27: PAD13.1 66.91,86.54 R30.1 R31.2 | R31.2
N$39
  Bottom 1.27: T12.2 PAD14.1 64.37,84.95 R32.1
N$40
  Bottom 1.27: R15.1 49.45,46.91 47.47,48.89 T3.3
N$41
  Bottom 1.27: R55.1 95.88,78.82 94.93,79.77 94.93,82.39 97.55,85.01 98.9,85.01 100.17,86.28 PAD5.1
N$42
  Bottom 1.27: R33.2 49.47,77.88 51.75,80.17 51.75,83.95 D11.C
N$43
  Bottom 1.27: T13.1 47.15,81.44 C17.1 49.64,83.93 R33.1
N$44
  Bottom 1.27: R34.1 77.53,77.72 74.77,80.49 74.77,83.96 D12.A
N$45  (1 unrouted)
  Bottom 1.27: T14.1 79.93,81.32 R34.2
N$46
  Bottom 1.016: D3.A 98.19,73.42 100.89,76.12 115.17,76.12 117.16,74.22 117.16,65.25 116.68,64.77 113.97,64.77 R36.2
N$47
  Bottom 1.016: C17.2 42.08,81.55 42.15,81.61
  Bottom 1.27: R37.1 42.15,81.61 43.8,81.61 44.61,80.8 T13.2 | T13.2 | T13.2 | D5.A 42.86,73.42 T13.2
N$48
  Bottom 1.27: C18.2 82.55,78.85 T14.2 82.39,78.66 82.39,74.53 83.5,73.42 D3.C
  Bottom 1.676: R38.1 85.15,81.42 T14.2
N$49
  Bottom 0.813: T1.1 47.15,44.53 47.78,43.89 50.96,43.89 51.59,43.26 51.59,39.45 51.67,39.37
  Bottom 1.016: R15.2 51.43,39.29 51.59,39.45
  Bottom 1.27: R15.2 R16.2 | R16.2
N$50
  Bottom 1.27: R63.1 59.17,87.47 R39.2
N$51
  Bottom 0.813: R51.1 82.15,46.83 83.34,45.64 86.12,45.64 87.63,47.15 87.63,47.86 T6.3
N$52  (via drill 0.6 pad 3.81)
  other vias: 52.15,102.87
N$53  (2 unrouted)
  Bottom 0.813: 18.57,18.57 34.53,18.57
  Bottom 1.016: 34.53,18.57 34.53,18.89 | R27.1 18.57,18.57 | PAD7.1 37.62,95.81 37.58,95.61
  Bottom 1.27: D20.K 8.02,72.87 C23.C+ 8.33,74.77 8.33,77.87 | C21.C+ 7.22,79.38 7.3,79.3 | 19.29,94.3 19.29,94.85 18.1,96.04
  Bottom 1.422: 51.99,94.06 50.8,96.04 44.37,96.04 | 18.1,96.04 37.23,96.04 | 37.23,96.04 44.37,96.04 | 37.23,96.04 37.58,95.61 37.54,94.06 | C25.2 44.53,95.33 44.37,96.04 | C24.2 R17.2 | C24.2 | F1.1 9.83,43.82 15.24,38.42 15.24,21.91 R27.1
  Bottom 2.54: 7.3,59.69 9.6,57.4 F1.1 8.92,55.13 7.06,57.15 7.06,85.65 | 7.3,59.69 7.3,79.3 7.3,85.8 | 7.06,85.65 7.3,85.8 | C27.2 7.22,88.19 7.46,88.58 7.3,86.2 7.3,85.8 | 7.3,59.69 8.1,59.69 8.33,59.21 8.33,77.87 7.62,78.82 | 7.06,85.65 7.06,91.84 9.6,94.3 19.29,94.3 PAD1.1
N$54
  Bottom 0.813: 97.23,18.73 97.39,18.73 97.95,18.26 108.51,18.26 R28.2
  Bottom 1.016: 93.42,18.73 97.23,18.73 | C29.1 93.42,18.73 | 93.42,18.73 | C26.2 82.87,89.06 82.23,88.42 81.84,88.03 77.07,88.03 76.52,88.58 PAD16.1 | 109.7,95.88 108.98,95.88 PAD4.1
  Bottom 1.27: 90.09,95.88 84.14,95.88 82.95,94.69 82.95,90.86 C26.2 82.75,90.8 | 109.7,95.88 90.09,95.88 | 90.09,95.88 90.41,95.57 PAD20.1 | 120.33,90.96 120.33,88.74 C31.1 119.78,83.17 C30.C- | 120.17,75.72 120.17,73.74 C19.C- | D21.A 120.33,65.17 120.17,65.01
  Bottom 1.422: R18.1 C29.1 | C29.1 | R28.2 112.87,22.54 112.87,38.26 118.39,43.78 F2.1
  Bottom 2.54: 120.17,75.72 120.17,65.01 120.17,63.9 119.22,62.94 119.22,57.31 117.47,55.56 117.47,55.01 117.57,54.91 F2.1 118.65,54.91 120.33,56.59 120.33,90.96 120.33,91.36 116.28,95.41 108.51,95.41 PAD4.1
N$55
  Bottom 0.813: T4.1 87,43.97 84.38,41.35 83.18,41.35 80.96,43.58 77.79,43.58 76.99,42.78 76.99,39.29 77.07,39.21
  Bottom 1.27: R29.2 77.07,39.21 R51.2
N$56
  Bottom 1.27: PAD10.1 40.08,88.9 35.96,84.69 35.96,78.9 35.8,78.74
  Bottom 1.422: R40.2 31.59,75.96 34.21,78.74 35.8,78.74 39.82,78.74 R54.1
N$57
  Bottom 1.27: R41.1 97.7,76.12 92.55,76.12 90.05,78.62 87.65,78.62 R55.2 87.68,78.74 89.93,78.74 92.95,81.76 PAD21.1
N$58  (via drill 2.2 pad 6.45)
  Bottom 1.93: R37.2 25.07,81.61 24.05,82.63
  other vias: 25.96,88.11
  pour Bottom (no thermals): 12.54,83.74 12.54,80.72 12.86,80.41 26.99,80.41 27.3,80.72 27.3,84.22 29.29,86.2 29.29,90.73 28.65,91.36 24.05,91.36 22.78,90.09 22.78,84.61 22.3,84.14 12.94,84.14
N$59  (via drill 2.8 pad 6.45)
  Bottom 1.422: R38.2 100.28,81.42 R49.1
  other vias: 113.19,88.03
  pour Bottom (no thermals): 99.85,80.49 114.54,80.49 116.6,82.55 116.6,90.09 115.41,91.28 111.12,91.28 109.85,90.01 109.85,85.33 108.74,84.22 101.2,84.22 99.46,82.47 99.46,80.8 99.77,80.49 99.77,80.57
N$60  (via drill 0.6 pad 3.81)
  other vias: 64.37,102.87
N$61  (1 unrouted)
  Bottom 6.452: F1.2 9.83,21.8 X1.1
N$62  (via drill 2.2 pad 6.45)
  other vias: 13.57,88.11
N$63
  Bottom 1.422: X5.2 X5.1
  Bottom 6.452: F2.2 118.39,21.9 X5.2
N$64  (via drill 2.8 pad 6.45)
  other vias: 100.25,88.03
N$65  (via drill 2.2 pad 6.45)
  other vias: 19.53,94.14
N$66  (via drill 0.6 pad 3.81)
  other vias: 76.52,102.87
N$67
  Bottom 0.813: T5.1 84.45,38.81 89.3,43.66 90.71,43.66 92.66,41.7
  Bottom 1.27: LED2.A 92.51,39.25 93.81,40.55
  Bottom 1.422: C11.1 92.54,41.83 92.66,41.7 93.81,40.55 D10.A | C9.1 93.9,26.51 92.47,27.94 92.47,33.89 LED2.A
N$68  (via drill 0.6 pad 3.81)
  other vias: 90.41,108.59
N$69  (via drill 3.2 pad 6.45)
  other vias: 37.31,108.51
N$70  (via drill 2.8 pad 6.45)
  other vias: 106.84,93.82
N$71  (via drill 3.2 pad 6.45)
  other vias: 52.07,102.87
N$72  (via drill 3.2 pad 6.45)
  other vias: 64.37,102.95
N$73  (via drill 3.2 pad 6.45)
  other vias: 76.52,102.95
N$74  (via drill 3.2 pad 6.45)
  other vias: 90.49,108.59
N$76
  Bottom 1.016: T14.3 88.74,76.2 90.41,74.53 90.41,69.06 90.65,68.82
  Bottom 1.27: T13.3 | T13.3 R40.1 36.75,75.88 31.11,70.25 25.09,70.25 R65.1
  Bottom 1.422: T14.3 R41.2 | T14.3
  Bottom 1.93: 72.47,60.8 72.31,60.96 | R26.2 75.14,52.34 R56.2
  Bottom 2.54: R50.2 69.45,66.6 67.15,68.9 66.91,68.9 | 66.91,68.9 24.53,68.9 23.97,69.45 | R73.2 102.23,70.33 100.73,68.82 90.65,68.82 66.99,68.82 66.91,68.9
  pour Bottom (isolate 0.813, no thermals): 67.87,68.26 67.87,66.83 67.87,57.07 93.03,57.07 93.03,64.45 77.71,64.45 77.71,68.34
  pour Bottom (no thermals): 99.77,73.03 99.77,66.68 115.81,66.68 115.81,73.1 99.77,73.1 99.77,73.03
  pour Bottom (no thermals): 12.54,72.55 12.54,66.68 26.51,66.68 26.51,72.79 12.54,72.79
N$77  (via drill 0.8 pad 1.78)  (1 unrouted)
  Top 1.422: v103.98,49.45 103.98,39.21
  Bottom 1.27: R25*.1 98.42,55.01 v103.98,49.45
  Bottom 1.422: v103.98,49.45 103.9,49.53
  Bottom 1.676: T10.3 101.28,41.91 102.31,40.88 | 102.31,40.88 103.98,39.21 | T8.3 100.17,38.73 102.31,40.88
N$89  (via drill 0.8 pad 1.93)  (1 unrouted)
  Top 1.27: v88.9,23.81 78.58,23.81 v78.65,23.89
  Bottom 1.016: v78.65,23.89 78.96,23.91
  Bottom 1.27: v78.65,23.89 78.95,23.89 78.96,23.91 | P1.1 61.83,18.65 64.06,15.95 80.25,15.95 81.76,17.78 81.76,23.18 81.12,23.81 78.82,23.81 0R.1 | 49.29,18.89 C34.2 | C4.C+ 88.98,23.73 v88.9,23.81 | D1.C 49.29,18.73 R17.1
  Bottom 1.422: v88.9,23.81 88.9,23.73
  Bottom 1.676: R17.1 49.29,18.89 61.44,18.89 P1.1
  pour Bottom (no thermals): 85.65,26.99 85.65,23.26 85.96,22.94 89.77,22.94 90.33,23.5 90.33,26.67 89.69,27.31 85.96,27.31
N$180
  Bottom 3.81: 20.71,58.34 20.63,58.5 R68.2 | 20.71,58.34 R53.2 | C20*.2 20.47,60.48 20.71,58.34
N$181
  Bottom 1.27: C1.1 64.39,32.08 C22.1
  Bottom 1.422: K1.1 63.1,29.21 64.37,30.48 C22.1 | C22.1
  Bottom 1.93: C1.1 60.58,32.08 C16.1
OUT
  pour Bottom (isolate 0.813, no thermals): 49.61,64.14 52.15,66.68 60.48,66.68 60.48,57.31 34.77,57.23 34.77,64.14

### Text on the board
Bottom: MIR 50